# EAGLE schematic hdd-cable (EAGLE 9.2.2)
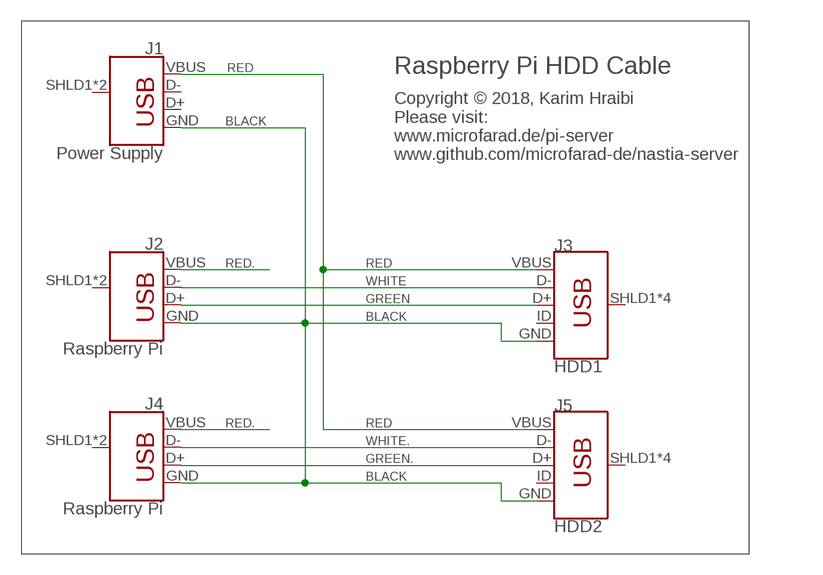
[diagram p0: schematic, sheet 1]

## Parts
J1  Power Supply  USB_A_PTH_MALE  [USB-A-H]
J2  Raspberry Pi  USB_A_PTH_MALE  [USB-A-H]
J3  HDD1  USB_MICRO-B_MALE-VERT  [USB_MICROB_VERTICAL]
J4  Raspberry Pi  USB_A_PTH_MALE  [USB-A-H]
J5  HDD2  USB_MICRO-B_MALE-VERT  [USB_MICROB_VERTICAL]

## Nets
BLACK: J1.GND J2.GND J3.GND J4.GND J5.GND
GREEN: J2.D+ J3.D+
GREEN.: J4.D+ J5.D+
RED: J1.VBUS J3.VBUS J5.VBUS
RED.: J2.VBUS J4.VBUS
WHITE: J2.D- J3.D-
WHITE.: J4.D- J5.D-
Unconnected: J1.D+ J1.D- J1.SHLD1(SHIELD) J1.SHLD2(SHIELD) J2.SHLD1(SHIELD) J2.SHLD2(SHIELD) J3.ID J3.SHLD1(SHIELD) J3.SHLD2(SHIELD) J3.SHLD3(SHIELD) J3.SHLD4(SHIELD) J4.SHLD1(SHIELD) J4.SHLD2(SHIELD) J5.ID J5.SHLD1(SHIELD) J5.SHLD2(SHIELD) J5.SHLD3(SHIELD) J5.SHLD4(SHIELD)

## Notes on the sheet
- Raspberry Pi HDD Cable
- Copyright © 2018, Karim Hraibi
  Please visit:
  www.microfarad.de/pi-server
  www.github.com/microfarad-de/nastia-server

## Library data of the parts
J1 J2 J4 = SparkFun-Connectors:USB_A: USB-A Connector Male and female variants, as well as PTH and SMT variants SparkFun Products: SparkFun XBee Explorer Dongle <https://www.sparkfun.com/products/11697> PTH Male SparkFun MicroView-USB Programmer <https://www.sparkfun.com/products/12924> SMT Male SparkFun USB Type A Female Breakout <https://www.sparkfun.com/products/12700> SMT Female; PROD_ID: CONN-08367; SF_ID: PRT-00437
J3 J5 = SparkFun-Connectors:USB_MICRO-B: USB Type Micro-B Connector Male/female and PTH/SMT variants SparkFun Products: SparkFun microB USB Breakout <https://www.sparkfun.com/products/12035> SparkFun USB microB Plug Breakout <https://www.sparkfun.com/products/10031> SparkFun ESP8266 Thing <https://www.sparkfun.com/products/13231>; PROD_ID: CONN-09900